# Altium schematic sheet schematic.SchDoc
size A4
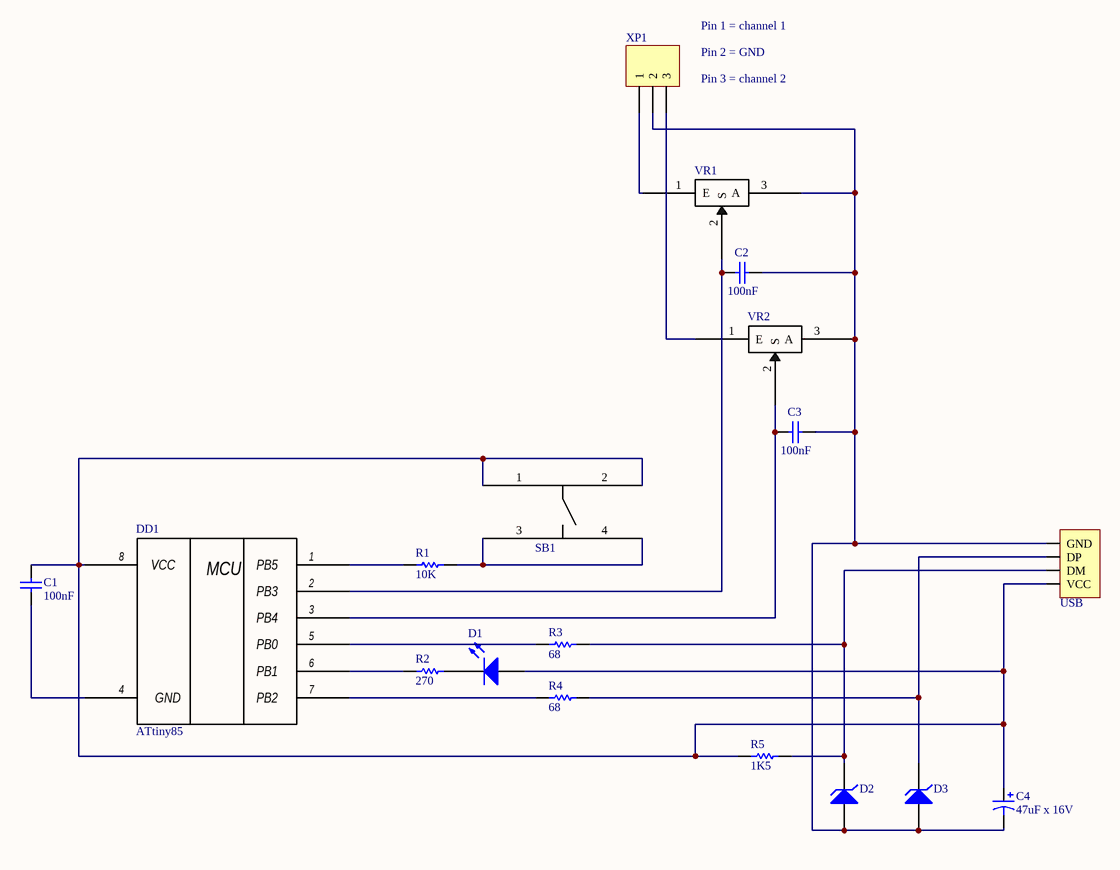
[diagram p0: schematic.SchDoc]

## Parts
C1  100nF  [RAD-0.1]
C2  100nF  [RAD-0.1]
C3  100nF  [RAD-0.1]
C4  47uF x 16V  [HDR1X2]
D1  (no value)  [HDR1X2]
D2  Zener  [DO-35]  (value not drawn)
D3  Zener  [DO-35]  (value not drawn)
DD1  ATtiny85  [DIP-8-300]
R1  10K  [AXIAL-0.3]
R2  270  [AXIAL-0.3]
R3  68  [AXIAL-0.3]
R4  68  [AXIAL-0.3]
R5  1K5  [AXIAL-0.3]
SB1  Button TACT-64K  [Button TACT-64K]  (value not drawn)
USB  USB_TypeB  [USB_TypeB]  (value not drawn)
VR1  Potentiometer  [Potentiometer]  (value not drawn)
VR2  Potentiometer  [Potentiometer]  (value not drawn)
XP1  WF-03R  [HDR1X3]  (value not drawn)

## Nets
NetC1_1: C1.1 DD1.4(GND)
NetC1_2: C1.2 C4.1 D1.1(A) DD1.8(VCC) R5.2 SB1.1 SB1.2 USB.1(VCC)
NetC2_1: C2.1 C3.1 C4.2 D2.1(A) D3.1(A) USB.4(GND) VR1.3(A) VR2.3(A) XP1.2
NetC2_2: C2.2 DD1.2(PB3) VR1.2(S)
NetC3_2: C3.2 DD1.3(PB4) VR2.2(S)
NetD1_2: D1.2(K) R2.2
NetD2_2: D2.2(K) R3.2 R5.1 USB.2(DM)
NetD3_2: D3.2(K) R4.2 USB.3(DP)
NetDD1_1: DD1.1(PB5) R1.1
NetDD1_5: DD1.5(PB0) R3.1
NetDD1_6: DD1.6(PB1) R2.1
NetDD1_7: DD1.7(PB2) R4.1
NetR1_2: R1.2 SB1.3 SB1.4
NetVR1_1: VR1.1(E) XP1.1
NetVR2_1: VR2.1(E) XP1.3

## Notes on the sheet
- Pin 1 = channel 1
- (near XP1) Pin 2 = GND
- (near XP1) Pin 3 = channel 2
- (in symbol ATtiny85) MCU

## Library data of the parts
C1-C3 = Cap: Capacitor; Published: 8-Jun-2000; LatestRevisionDate: 17-Jul-2002; LatestRevisionNote: Re-released for DXP Platform.; PackageReference: RAD-0.3; Publisher: Altium Limited; PackageDescription: Radial Cap, Thru-Hole; 2 Leads; 0.3 in Pin Spacing; Value: 100nF
C4 = Cap Pol1: Polarized Capacitor (Radial); Published: 8-Jun-2000; LatestRevisionDate: 17-Jul-2002; LatestRevisionNote: Re-released for DXP Platform.; PackageReference: RB7.6-15; Publisher: Altium Limited; PackageDescription: Polarized Capacitor (Radial); 2 Leads; Value: 47uF x 16V
D1 = LED1: Typical RED GaAs LED; Published: 8-Jun-2000; LatestRevisionDate: 08-Jul-2005; LatestRevisionNote: Mech Layer 1 removed.; PackageReference: LED-1; Publisher: Altium Limited; PackageDescription: LED; 2 Leads
D2 D3 = D Zener: Zener Diode; Published: 8-Jun-2000; LatestRevisionDate: 17-Jul-2002; LatestRevisionNote: Re-released for DXP Platform.; PackageReference: DIODE-0.7; Publisher: Altium Limited; PackageDescription: Diode, Thru-Hole; 2 Leads; 0.7 in Pin Spacing
DD1 = ATtiny85: 8-bit AVR MCU; LatestRevisionDate: 08-Apr-2015; LatestRevisionNote: Release; Publisher: Victor Grigoryev; PackageDescription: 8-bit AVR MCU; DIP-8; Datasheet: http://www.atmel.com/Images/Atmel-2586-AVR-8-bit-Microcontroller-ATtiny25-ATtiny45-ATtiny85_Datasheet.pdf
R1-R5 = Res1: Resistor; Published: 8-Jun-2000; LatestRevisionDate: 17-Jul-2002; LatestRevisionNote: Re-released for DXP Platform.; PackageReference: AXIAL-0.3; Publisher: Altium Limited; PackageDescription: Axial Device, Thru-Hole; 2 Leads; 0.3 in Pin Spacing
  R1: Value: 10K
  R2: Value: 270
  R3 R4: Value: 68
  R5: Value: 1K5
SB1 = Button TACT-64K: My standart switch button; LatestRevisionDate: 28-Mar-2015; LatestRevisionNote: Release; Publisher: Victor Grigoryev; PackageDescription: Tact switch; 4 pins; Datasheet: http://www.ninigi.com/usrFiles/docs/tact-64k.pdf
USB = USB_TypeB: USB
XP1 = Header 3: Header, 3-Pin; LatestRevisionDate: 17-Jul-2002; LatestRevisionNote: Re-released for DXP Platform.; Publisher: Altium Limited
VR1 VR2 = Potentiometer: LatestRevisionDate: 08-Apr-2015; LatestRevisionNote: Release; Publisher: Victor Grigoryev; PackageDescription: Potentiometer; 3 pins